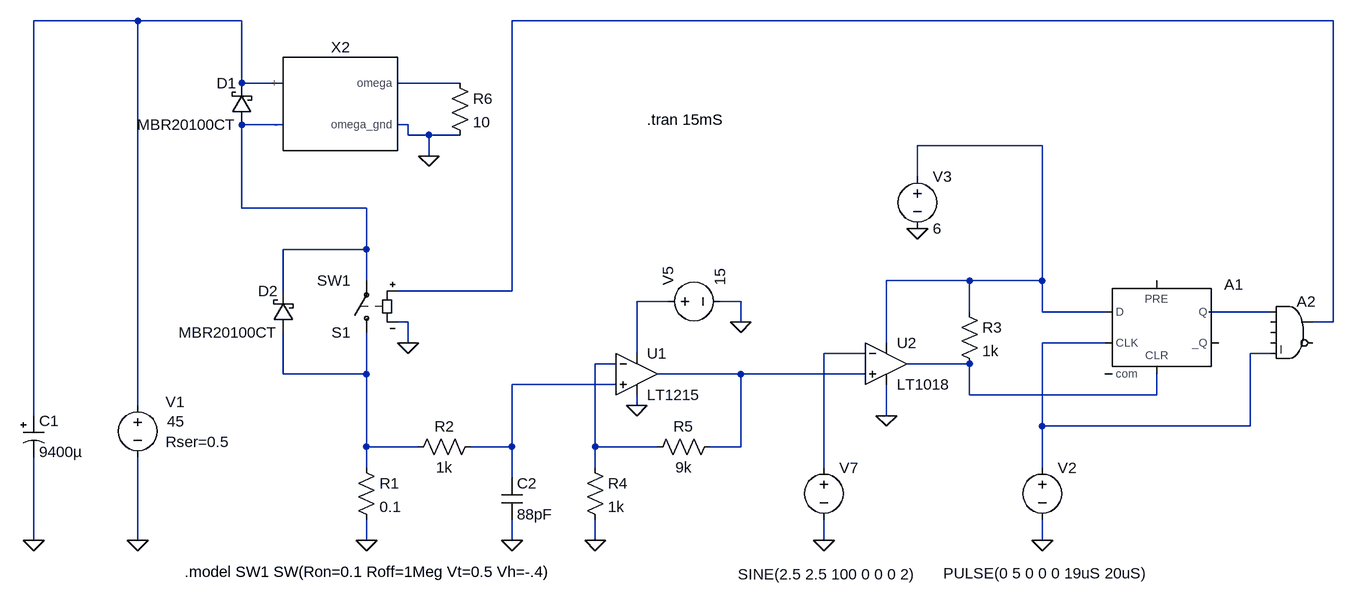
[diagram p0: schematic CURRENT PWM and DC Motor.asc]
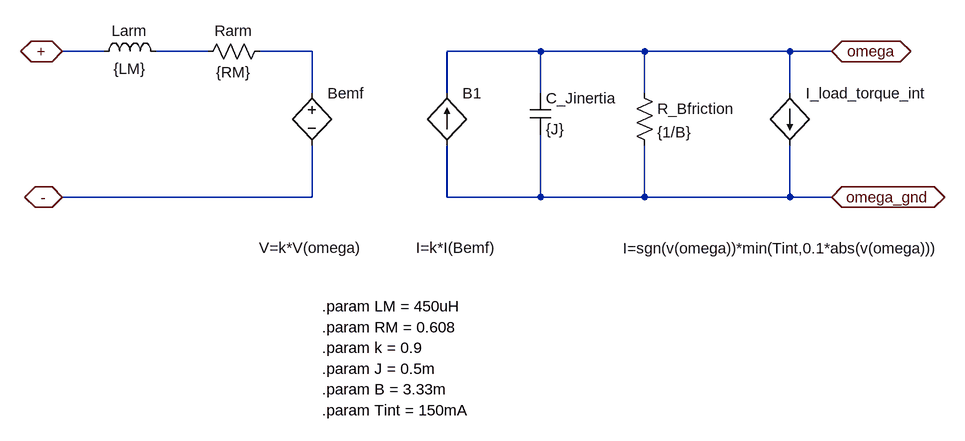
[diagram p1: sub-circuit dc_motor.asc]
CURRENT PWM and DC Motor.asc, the LTspice schematic file:
Version 4
SHEET 1 1868 772
WIRE -288 -432 -448 -432
WIRE -128 -432 -288 -432
WIRE 1552 -432 288 -432
WIRE -128 -336 -128 -432
WIRE -64 -336 -128 -336
WIRE 208 -336 112 -336
WIRE -64 -272 -128 -272
WIRE 128 -272 112 -272
WIRE 128 -256 128 -272
WIRE 160 -256 128 -256
WIRE 208 -256 160 -256
WIRE 1104 -240 912 -240
WIRE 160 -224 160 -256
WIRE 912 -192 912 -240
WIRE -128 -144 -128 -272
WIRE 64 -144 -128 -144
WIRE 64 -80 64 -144
WIRE 64 -80 -64 -80
WIRE 64 -32 64 -80
WIRE 992 -32 864 -32
WIRE 1104 -32 1104 -240
WIRE 1104 -32 992 -32
WIRE -64 -16 -64 -80
WIRE 288 -16 288 -432
WIRE 288 -16 112 -16
WIRE 528 0 480 0
WIRE 640 0 608 0
WIRE 992 16 992 -32
WIRE 1104 16 1104 -32
WIRE 1200 16 1104 16
WIRE 1456 16 1360 16
WIRE 128 32 112 32
WIRE 640 32 640 0
WIRE 1552 32 1552 -432
WIRE 1552 32 1520 32
WIRE 128 64 128 32
WIRE 864 64 864 -32
WIRE 1200 64 1104 64
WIRE 480 80 480 0
WIRE 832 80 768 80
WIRE 1456 80 1424 80
WIRE 448 96 416 96
WIRE 992 96 896 96
WIRE -64 112 -64 48
WIRE 64 112 64 48
WIRE 64 112 -64 112
WIRE 640 112 512 112
WIRE 832 112 640 112
WIRE 448 128 288 128
WIRE 992 144 992 96
WIRE 1280 144 1280 112
WIRE 1280 144 992 144
WIRE -288 160 -288 -432
WIRE 480 160 480 144
WIRE -448 176 -448 -432
WIRE 864 176 864 128
WIRE 1104 192 1104 64
WIRE 1424 192 1424 80
WIRE 1424 192 1104 192
WIRE 64 224 64 112
WIRE 144 224 64 224
WIRE 288 224 288 128
WIRE 288 224 224 224
WIRE 416 224 416 96
WIRE 512 224 416 224
WIRE 640 224 640 112
WIRE 640 224 592 224
WIRE 64 256 64 224
WIRE 416 256 416 224
WIRE 768 256 768 80
WIRE 1104 256 1104 192
WIRE 288 272 288 224
WIRE -448 368 -448 240
WIRE -288 368 -288 240
WIRE 64 368 64 336
WIRE 288 368 288 336
WIRE 416 368 416 336
WIRE 768 368 768 336
WIRE 1104 368 1104 336
FLAG 64 368 0
FLAG -288 368 0
FLAG 1104 368 0
FLAG 912 -112 0
FLAG 864 176 0
FLAG 288 368 0
FLAG 416 368 0
FLAG 480 160 0
FLAG 640 32 0
FLAG 128 64 0
FLAG 768 368 0
FLAG -448 368 0
FLAG 160 -224 0
SYMBOL res 48 240 R0
SYMATTR InstName R1
SYMATTR Value 0.1
SYMBOL schottky -112 -272 R180
WINDOW 0 24 64 Left 2
WINDOW 3 24 0 Left 2
SYMATTR InstName D1
SYMATTR Value MBR20100CT
SYMATTR Description Diode
SYMATTR Type diode
SYMBOL res 240 208 R90
WINDOW 0 0 56 VBottom 2
WINDOW 3 32 56 VTop 2
SYMATTR InstName R2
SYMATTR Value 1k
SYMBOL cap 272 272 R0
SYMATTR InstName C2
SYMATTR Value 88pF
SYMBOL Digital\\dflop 1280 -32 R0
WINDOW 3 0 0 Invisible 2
SYMATTR Value 5
SYMATTR InstName A1
SYMBOL voltage -288 144 R0
WINDOW 3 45 41 Left 2
WINDOW 123 0 0 Left 2
WINDOW 39 43 72 Left 2
WINDOW 0 43 11 Left 2
SYMATTR Value 45
SYMATTR SpiceLine Rser=0.5
SYMATTR InstName V1
SYMBOL voltage 1104 240 R0
WINDOW 123 0 0 Left 2
WINDOW 39 0 0 Left 2
WINDOW 3 -152 179 Left 2
SYMATTR Value PULSE(0 5 0 0 0 19uS 20uS)
SYMATTR InstName V2
SYMBOL voltage 912 -208 R0
WINDOW 123 0 0 Left 2
WINDOW 39 0 0 Left 2
SYMATTR InstName V3
SYMATTR Value 6
SYMBOL schottky -48 48 R180
WINDOW 0 24 64 Left 2
WINDOW 3 24 0 Left 2
SYMATTR InstName D2
SYMATTR Value MBR20100CT
SYMATTR Description Diode
SYMATTR Type diode
SYMBOL res 976 0 R0
SYMATTR InstName R3
SYMATTR Value 1k
SYMBOL Comparators\\LT1018 864 96 R0
SYMATTR InstName U2
SYMBOL sw 64 64 R180
SYMATTR InstName S1
SYMATTR Value SW1
SYMBOL Opamps\\LT1215 480 48 R0
SYMATTR InstName U1
SYMBOL res 400 240 R0
SYMATTR InstName R4
SYMATTR Value 1k
SYMBOL res 608 208 R90
WINDOW 0 0 56 VBottom 2
WINDOW 3 32 56 VTop 2
SYMATTR InstName R5
SYMATTR Value 9k
SYMBOL voltage 512 0 R270
WINDOW 123 0 0 Left 2
WINDOW 39 0 0 Left 2
SYMATTR InstName V5
SYMATTR Value 15
SYMBOL Digital\\and 1488 -16 R0
SYMATTR InstName A2
SYMBOL voltage 768 240 R0
WINDOW 3 -132 180 Left 2
WINDOW 123 0 0 Left 2
WINDOW 39 0 0 Left 2
SYMATTR Value SINE(2.5 2.5 100 0 0 0 2)
SYMATTR InstName V7
SYMBOL polcap -464 176 R0
WINDOW 3 24 56 Left 2
SYMATTR Value 9400µ
SYMATTR InstName C1
SYMATTR Description Capacitor
SYMATTR Type cap
SYMATTR SpiceLine V=63 Irms=10 Rser=0.032 Lser=0
SYMBOL res 192 -352 R0
SYMATTR InstName R6
SYMATTR Value 10
SYMBOL DC_Motor 16 -304 R0
SYMATTR InstName X2
TEXT 496 -280 Left 2 !.tran 15mS
TEXT -216 416 Left 2 !.model SW1 SW(Ron=0.1 Roff=1Meg Vt=0.5 Vh=-.4)

dc_motor.asc, the sub-circuit schematic file:
Version 4
SHEET 1 1828 680
WIRE 0 -256 -64 -256
WIRE 160 -256 80 -256
WIRE 320 -256 240 -256
WIRE 672 -256 528 -256
WIRE 832 -256 672 -256
WIRE 1056 -256 832 -256
WIRE 1120 -256 1056 -256
WIRE 320 -192 320 -256
WIRE 528 -192 528 -256
WIRE 672 -192 672 -256
WIRE 832 -192 832 -256
WIRE 1056 -192 1056 -256
WIRE 320 -32 320 -112
WIRE 320 -32 -64 -32
WIRE 528 -32 528 -112
WIRE 672 -32 672 -128
WIRE 672 -32 528 -32
WIRE 832 -32 832 -112
WIRE 832 -32 672 -32
WIRE 1056 -32 1056 -112
WIRE 1056 -32 832 -32
WIRE 1120 -32 1056 -32
FLAG -64 -256 +
IOPIN -64 -256 BiDir
FLAG -64 -32 -
IOPIN -64 -32 BiDir
FLAG 1120 -256 omega
IOPIN 1120 -256 BiDir
FLAG 1120 -32 omega_gnd
IOPIN 1120 -32 BiDir
SYMBOL ind -16 -240 R270
WINDOW 0 32 56 VTop 2
WINDOW 3 5 56 VBottom 2
SYMATTR InstName Larm
SYMATTR Value {LM}
SYMBOL res 256 -272 R90
WINDOW 0 0 56 VBottom 2
WINDOW 3 32 56 VTop 2
SYMATTR InstName Rarm
SYMATTR Value {RM}
SYMBOL bi2 528 -192 R0
WINDOW 3 -48 238 Left 2
SYMATTR Value I=k*I(Bemf)
SYMATTR InstName B1
SYMBOL cap 656 -192 R0
SYMATTR InstName C_Jinertia
SYMATTR Value {J}
SYMBOL res 816 -208 R0
SYMATTR InstName R_Bfriction
SYMATTR Value {1/B}
SYMBOL bi 1056 -192 R0
WINDOW 3 -257 239 Left 2
SYMATTR Value I=sgn(v(omega))*min(Tint,0.1*abs(v(omega)))
SYMATTR InstName I_load_torque_int
SYMBOL bv 320 -208 R0
WINDOW 3 -81 254 Left 2
SYMATTR Value V=k*V(omega)
SYMATTR InstName Bemf
TEXT 336 168 Left 2 !.param RM = 0.608
TEXT 336 200 Left 2 !.param k = 0.9
TEXT 336 232 Left 2 !.param J = 0.5m
TEXT 336 264 Left 2 !.param B = 3.33m
TEXT 336 296 Left 2 !.param Tint = 150mA
TEXT 336 136 Left 2 !.param LM = 450uH

The netlist it stands for:
* CURRENT PWM and DC Motor.asc
R1 N012 0 0.1
D1 N004 N001 MBR20100CT
R2 N014 N012 1k
C2 N014 0 88pF
A1 N005 0 N008 0 N011 0 N007 0 DFLOP 5
V1 N001 0 45 Rser=0.5
V2 N008 0 PULSE(0 5 0 0 0 19uS 20uS)
V3 N005 0 6
D2 N012 N004 MBR20100CT
R3 N005 N011 1k
XU2 N013 N009 N005 0 N011 LT1018  ; pins In+ In- V+ V- OUT
S1 N012 N004 N002 0 SW1
XU1 N014 N010 N006 0 N013 LT1215  ; pins In+ In- V+ V- OUT
R4 N010 0 1k
R5 N013 N010 9k
V5 N006 0 15
A2 N007 0 0 0 N008 0 N002 0 AND
V7 N009 0 SINE(2.5 2.5 100 0 0 0 2)
C1 N001 0 9400µ V=63 Irms=10 Rser=0.032 Lser=0
R6 N003 0 10
XX2 N001 N004 N003 0 dc_motor

* block symbol definitions
.subckt dc_motor + - omega omega_gnd
Larm + N001 {LM}
Rarm N002 N001 {RM}
B1 omega_gnd omega I=k*I(Bemf)
C_Jinertia omega omega_gnd {J}
R_Bfriction omega omega_gnd {1/B}
B§I_load_torque_int omega omega_gnd I=sgn(v(omega))*min(Tint,0.1*abs(v(omega)))
Bemf N002 - V=k*V(omega)
.param RM = 0.608
.param k = 0.9
.param J = 0.5m
.param B = 3.33m
.param Tint = 150mA
.param LM = 450uH
.ends dc_motor

.model D D
.lib standard.dio
.tran 15mS
.model SW1 SW(Ron=0.1 Roff=1Meg Vt=0.5 Vh=-.4)
.lib LTC1.lib
.lib LTC.lib
.backanno
.end